# Altium schematic sheet cong tac wifi TUYA.SchDoc
size A2
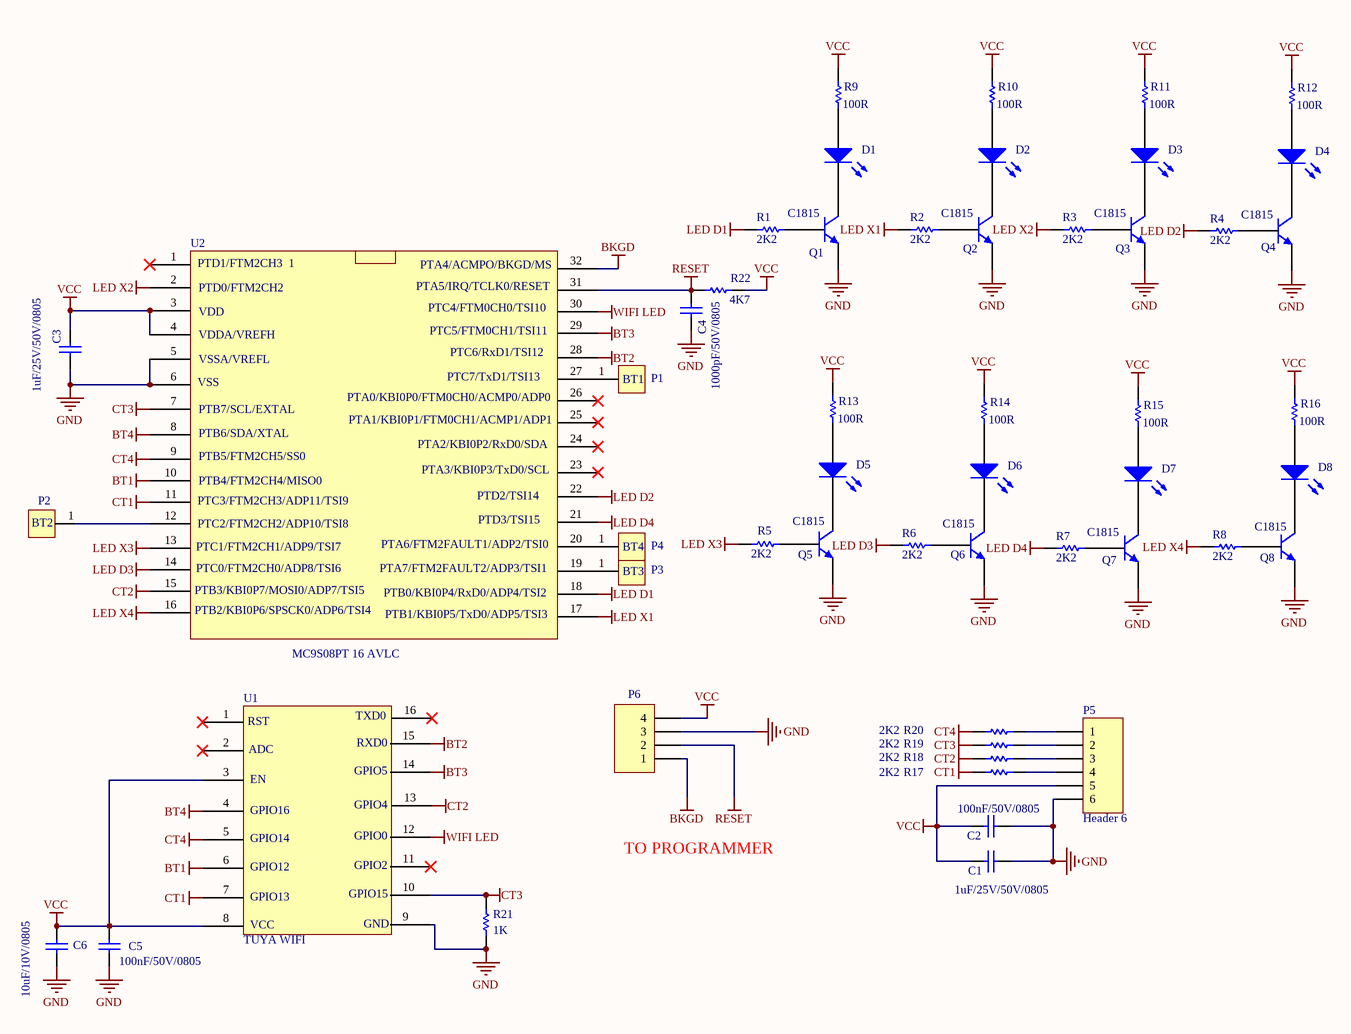
[diagram p0: cong tac wifi TUYA.SchDoc]

## Parts
C1  1uF/25V/50V/0805  [tu 0805]
C2  100nF/50V/0805  [tu 0805]
C3  1uF/25V/50V/0805  [tu 0805]
C4  1000pF/50V/0805  [tu 0805]
C5  100nF/50V/0805  [tu 0805]
C6  10uF/10V/0805  [tu 0805]
D1  (no value)  [LED 0805]
D2  (no value)  [LED 0805]
D3  (no value)  [LED 0805]
D4  (no value)  [LED 0805]
D5  (no value)  [LED 0805]
D6  (no value)  [LED 0805]
D7  (no value)  [LED 0805]
D8  (no value)  [LED 0805]
P1  BT1  [jum don]
P2  BT2  [jum don]
P3  BT3  [jum don]
P4  BT4  [jum don]
P5  Header 6  [Jum 6 nam]
P6  (no value)  [Jum 4 nho]
Q1  C1815  [C1815SMD]
Q2  C1815  [C1815SMD]
Q3  C1815  [C1815SMD]
Q4  C1815  [C1815SMD]
Q5  C1815  [C1815SMD]
Q6  C1815  [C1815SMD]
Q7  C1815  [C1815SMD]
Q8  C1815  [C1815SMD]
R1  2K2  [R0805]
R2  2K2  [R0805]
R3  2K2  [R0805]
R4  2K2  [R0805]
R5  2K2  [R0805]
R6  2K2  [R0805]
R7  2K2  [R0805]
R8  2K2  [R0805]
R9  100R  [R0805]
R10  100R  [R0805]
R11  100R  [R0805]
R12  100R  [R0805]
R13  100R  [R0805]
R14  100R  [R0805]
R15  100R  [R0805]
R16  100R  [R0805]
R17  2K2  [R0805]
R18  2K2  [R0805]
R19  2K2  [R0805]
R20  2K2  [R0805]
R21  1K  [R0805]
R22  4K7  [R0805]
U1  TUYA WIFI  [TUYA WIFI]
U2  MC9S08PT 16 AVLC  [M9S08PT 16AVLC]

## Nets
BKGD: P6.1 U2.32
BT1: U1.6 U2.10
BT2: U1.15 U2.28
BT3: U1.14 U2.29
BT4: U1.4 U2.8
CT1: R17.2 U1.7 U2.11
CT2: R18.2 U1.13 U2.15
CT3: R19.2 R21.1 U1.10 U2.7
CT4: R20.2 U1.5 U2.9
GND: C1.1 C2.1 C3.2 C4.2 C5.2 C6.2 P5.6 P6.3 Q1.3(E) Q2.3(E) Q3.3(E) Q4.3(E) Q5.3(E) Q6.3(E) Q7.3(E) Q8.3(E) R21.2 U1.9 U2.5 U2.6
LED D1: R1.2 U2.18
LED D2: R4.2 U2.22
LED D3: R6.2 U2.14
LED D4: R7.2 U2.21
LED X1: R2.2 U2.17
LED X2: R3.2 U2.2
LED X3: R5.2 U2.13
LED X4: R8.2 U2.16
RESET: C4.1 P6.2 R22.2 U2.31
VCC: C1.2 C2.2 C3.1 C5.1 C6.1 P5.5 P6.4 R9.1 R10.1 R11.1 R12.1 R13.1 R14.1 R15.1 R16.1 R22.1 U1.3 U1.8 U2.3 U2.4
WIFI LED: U1.12 U2.30
NetD1_1: D1.1(A) R9.2
NetD1_2: D1.2(K) Q1.1(C)
NetD2_1: D2.1(A) R10.2
NetD2_2: D2.2(K) Q2.1(C)
NetD3_1: D3.1(A) R11.2
NetD3_2: D3.2(K) Q3.1(C)
NetD4_1: D4.1(A) R12.2
NetD4_2: D4.2(K) Q4.1(C)
NetD5_1: D5.1(A) R13.2
NetD5_2: D5.2(K) Q5.1(C)
NetD6_1: D6.1(A) R14.2
NetD6_2: D6.2(K) Q6.1(C)
NetD7_1: D7.1(A) R15.2
NetD7_2: D7.2(K) Q7.1(C)
NetD8_1: D8.1(A) R16.2
NetD8_2: D8.2(K) Q8.1(C)
NetP1_1: P1.1 U2.27
NetP2_1: P2.1 U2.12
NetP3_1: P3.1 U2.19
NetP4_1: P4.1 U2.20
NetP5_1: P5.1 R20.1
NetP5_2: P5.2 R19.1
NetP5_3: P5.3 R18.1
NetP5_4: P5.4 R17.1
NetQ1_2: Q1.2(B) R1.1
NetQ2_2: Q2.2(B) R2.1
NetQ3_2: Q3.2(B) R3.1
NetQ4_2: Q4.2(B) R4.1
NetQ5_2: Q5.2(B) R5.1
NetQ6_2: Q6.2(B) R6.1
NetQ7_2: Q7.2(B) R7.1
NetQ8_2: Q8.2(B) R8.1

Not connected (* = marked no-connect by the designer): U1 1* 2* 11* 16*; U2 1* 23* 24* 25* 26*

## Notes on the sheet
- TO PROGRAMMER
- (in symbol M9S08PT 16AVLC) PTD1/FTM2CH3  1; PTA4/ACMPO/BKGD/MS; PTD0/FTM2CH2; PTA5/IRQ/TCLK0/RESET; PTC4/FTM0CH0/TSI10; VDD; VDDA/VREFH; PTC5/FTM0CH1/TSI11; PTC6/RxD1/TSI12; VSSA/VREFL; PTC7/TxD1/TSI13; VSS; PTA0/KBI0P0/FTM0CH0/ACMP0/ADP0; PTB7/SCL/EXTAL; PTA1/KBI0P1/FTM0CH1/ACMP1/ADP1; PTB6/SDA/XTAL; PTA2/KBI0P2/RxD0/SDA; PTB5/FTM2CH5/SS0; PTA3/KBI0P3/TxD0/SCL; PTB4/FTM2CH4/MISO0; PTD2/TSI14; PTC3/FTM2CH3/ADP11/TSI9; PTC2/FTM2CH2/ADP10/TSI8; PTD3/TSI15; PTA6/FTM2FAULT1/ADP2/TSI0; PTC1/FTM2CH1/ADP9/TSI7; PTC0/FTM2CH0/ADP8/TSI6; PTA7/FTM2FAULT2/ADP3/TSI1; PTB3/KBI0P7/MOSI0/ADP7/TSI5; PTB0/KBI0P4/RxD0/ADP4/TSI2; PTB2/KBI0P6/SPSCK0/ADP6/TSI4; PTB1/KBI0P5/TxD0/ADP5/TSI3
- (in symbol TUYA WIFI) RST; TXD0; RXD0; ADC; GPIO5; EN; GPIO4; GPIO16; GPIO0; GPIO14; GPIO12; GPIO2; GPIO13; GPIO15; GND; VCC

## Library data of the parts
C1-C6 = Cap: Capacitor
D1-D8 = LED0: Typical INFRARED GaAs LED
P1-P4 = Header 1
P5 = Header 6: Header, 6-Pin
P6 = Header 4: Header, 4-Pin
Q1-Q8 = npn: NPN Bipolar Transistor
R1-R22 = Res: Resistor
U2 = M9S08PT 16AVLC